# EAGLE design dc_controller_3 (EAGLE 4.16)
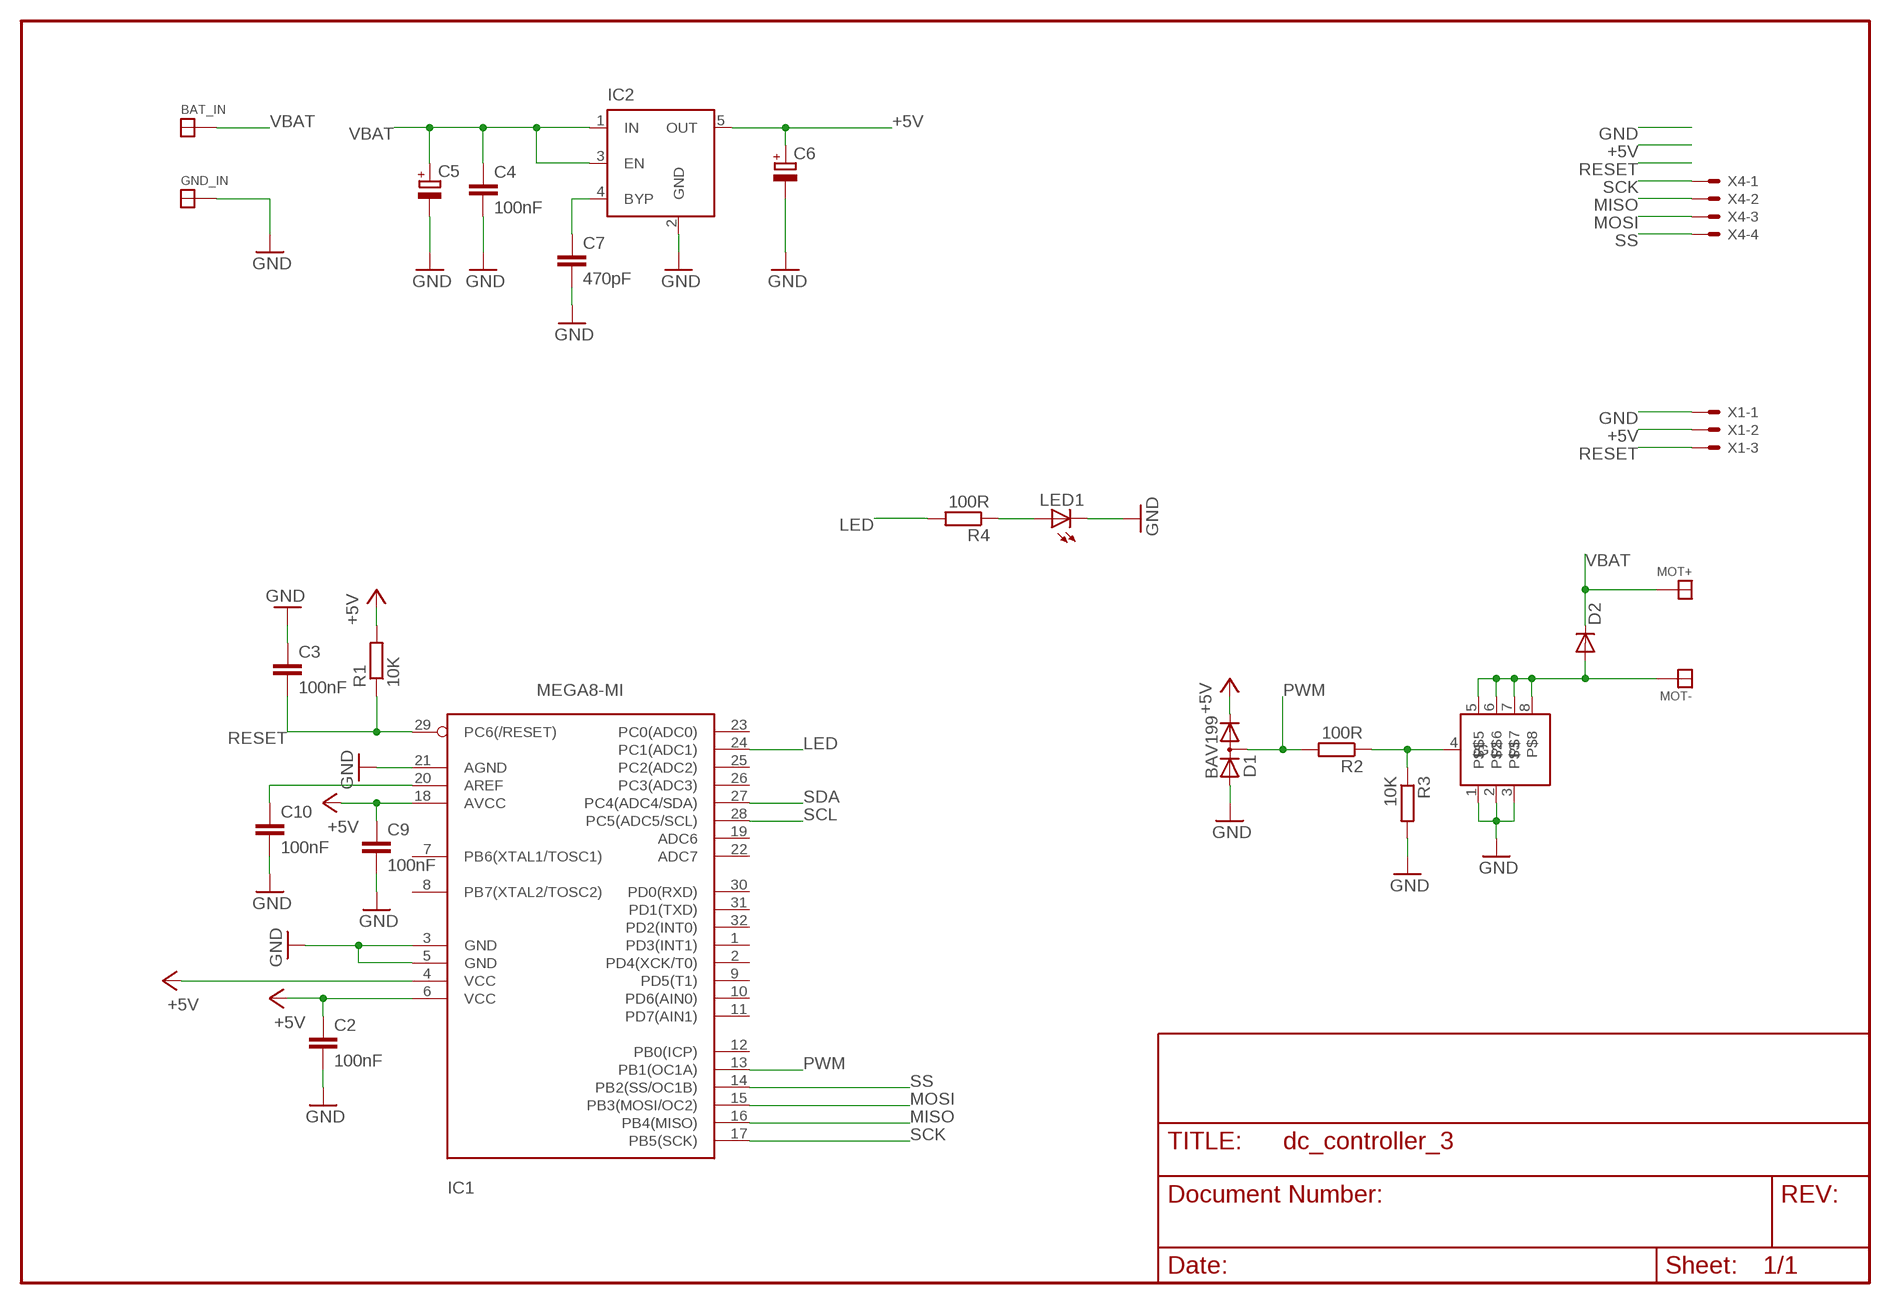
[diagram p0: schematic, sheet 1]

## Parts
BAT_IN  SOLDER_PAD100_50  [SOLDER_PAD_100_50]
C2  100nF  C-EUC0402K  [C0402K]
C3  100nF  C-EUC0402K  [C0402K]
C4  100nF  C-EUC0805  [C0805]
C5  CPOL-EUSMCB  [SMC_B]
C6  CPOL-EUSMCA  [SMC_A]
C7  470pF  C-EUC0402K  [C0402K]
C9  100nF  C-EUC0402K  [C0402K]
C10  100nF  C-EUC0402K  [C0402K]
D1  BAV199  [SOT23]
D2  DIODE-DO214BA  [DO214BA]
GND_IN  SOLDER_PAD100_50  [SOLDER_PAD_100_50]
IC1  MEGA8-MI  [MLF32]
IC2  MIC5219XX  [SOT23-5]
LED1  LEDCHIPLED_0805  [CHIPLED_0805]
MOT+  SOLDER_PAD100_50  [SOLDER_PAD_100_50]
MOT-  SOLDER_PAD100_50  [SOLDER_PAD_100_50]
R1  10K  R-EU_R0402  [R0402]
R2  100R  R-EU_R0402  [R0402]
R3  10K  R-EU_R0402  [R0402]
R4  100R  R-EU_R0402  [R0402]
U$1  IRF7809  [SO08]
X1  53047-03  [53047-03]
X4  53047-04  [53047-04]

## Nets
+5V: C2.1 C6.+ C9.1 D1.2(C) IC1.4(VCC) IC1.6(VCC) IC1.18(AVCC) IC2.5(OUT) R1.2 X1.2
GND: C2.2 C3.1 C4.2 C5.- C6.- C7.2 C9.2 C10.2 D1.1(A) GND_IN.P$1 IC1.3(GND) IC1.5(GND) IC1.21(AGND) IC2.2(GND) LED1.C R3.2 U$1.1 U$1.2 U$1.3 X1.1
LED: IC1.24(PC1(ADC1)) R4.2
MISO: IC1.16(PB4(MISO)) X4.2
MOSI: IC1.15(PB3(MOSI/OC2)) X4.3
MOT-: D2.A MOT-.P$1 U$1.5 U$1.6 U$1.7 U$1.8
N$1: C7.1 IC2.4(BYP)
N$4: LED1.A R4.1
N$5: C10.1 IC1.20(AREF)
N$6: R2.1 R3.1 U$1.4(G)
PWM: D1.3(AC) IC1.13(PB1(OC1A)) R2.2
RESET: C3.2 IC1.29(PC6(/RESET)) R1.1 X1.3
SCK: IC1.17(PB5(SCK)) X4.1
SCL: IC1.28(PC5(ADC5/SCL))
SDA: IC1.27(PC4(ADC4/SDA))
SS: IC1.14(PB2(SS/OC1B)) X4.4
VBAT: BAT_IN.P$1 C4.1 C5.+ D2.C IC2.1(IN) IC2.3(EN) MOT+.P$1
Unconnected: IC1.1(PD3(INT1)) IC1.2(PD4(XCK/T0)) IC1.7(PB6(XTAL1/TOSC1)) IC1.8(PB7(XTAL2/TOSC2)) IC1.9(PD5(T1)) IC1.10(PD6(AIN0)) IC1.11(PD7(AIN1)) IC1.12(PB0(ICP)) IC1.19(ADC6) IC1.22(ADC7) IC1.23(PC0(ADC0)) IC1.25(PC2(ADC2)) IC1.26(PC3(ADC3)) IC1.30(PD0(RXD)) IC1.31(PD1(TXD)) IC1.32(PD2(INT0))

## Library data of the parts
BAT_IN GND_IN MOT+ MOT- = paparazzi:SOLDER_PAD
C2-C4 C7 C9 C10 = rcl:C-EU: CAPACITOR, European symbol
C5 C6 = rcl:CPOL-EU: POLARIZED CAPACITOR, European symbol
D1 = diode:BAV199: DIODE low-leakage double diode
D2 = diode:DIODE-: DIODE
IC1 = atmel:MEGA8: MICROCONTROLLER 8 Kbytes FLASH 1 kbytes SRAM 512 bytes EEPROM USART 6-channel 10 bit ADC 2-channel 8 bit ADC Source: avr.lbr
IC2 = v-reg-micrel:MIC5219XX: VOLTAGE REGULATOR
LED1 = led:LED: LED OSRAM: - CHIPLED LG R971, LG N971, LY N971, LG Q971, LY Q971, LO R971, LY R971 LH N974, LH R974 LS Q976, LO Q976, LY Q976 LO Q996 - Hyper CHIPLED LW Q18S LB Q993, LB Q99A, LB R99A - SideLED LS A670, LO A670, LY A670, LG A670, LP A670 LB A673, LV A673, LT A673, LW A673 LH A674 LY A675 LS A676, LA A676, LO A676, LY A676, LW A676 LS A679, LY A679, LG A679 - Hyper Micro SIDELED® LS Y876, LA Y876, LO Y876, LY Y876 LT Y87S - SmartLED LW L88C, LW L88S LB L89C, LB L89S, LG L890 LS L89K, LO L89K, LY L89K LS L896, LA L896, LO L896, LY L896 - TOPLED LS T670, LO T670, LY T670, LG T670, LP T670 LSG T670, LSP T670, LSY T670, LOP T670, LYG T670 LG T671, LOG T671, LSG T671 LB T673, LV T673, LT T673, LW T673 LH T674 LS T676, LA T676, LO T676, LY T676, LB T676, LH T676, LSB T676, LW T676 LB T67C, LV T67C, LT T67C, LS T67K, LO T67K, LY T67K, LW E67C LS E67B, LA E67B, LO E67B, LY E67B, LB E67C, LV E67C, LT E67C LW T67C LS T679, LY T679, LG T679 LS T770, LO T770, LY T770, LG T770, LP T770 LB T773, LV T773, LT T773, LW T773 LH T774 LS E675, LA E675, LY E675, LS T675 LS T776, LA T776, LO T776, LY T776, LB T776 LHGB T686 LT T68C, LB T68C - Hyper Mini TOPLED® LB M676 - Mini TOPLED Santana® LG M470 LS M47K, LO M47K, LY M47K Source: http://www.osram.convergy.de/
R1-R4 = rcl:R-EU_: RESISTOR, European symbol
U$1 = paparazzi:IRF7809
X1 = con-molex:53?-03: CONNECTOR wire to board 1.25 mm (.049 inch) pitch header
X4 = con-molex:53?-04: CONNECTOR wire to board 1.25 mm (.049 inch) pitch header

## Board
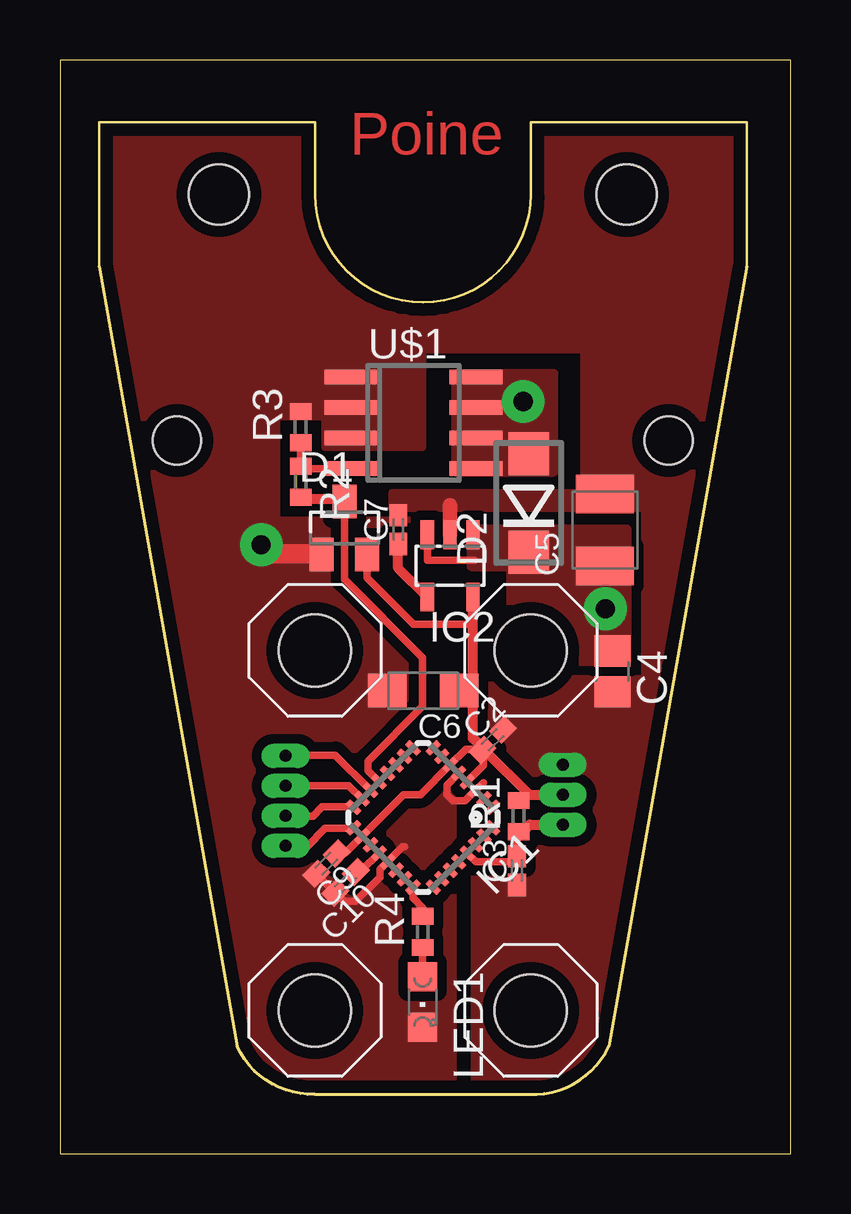
[diagram p1: board, top side]
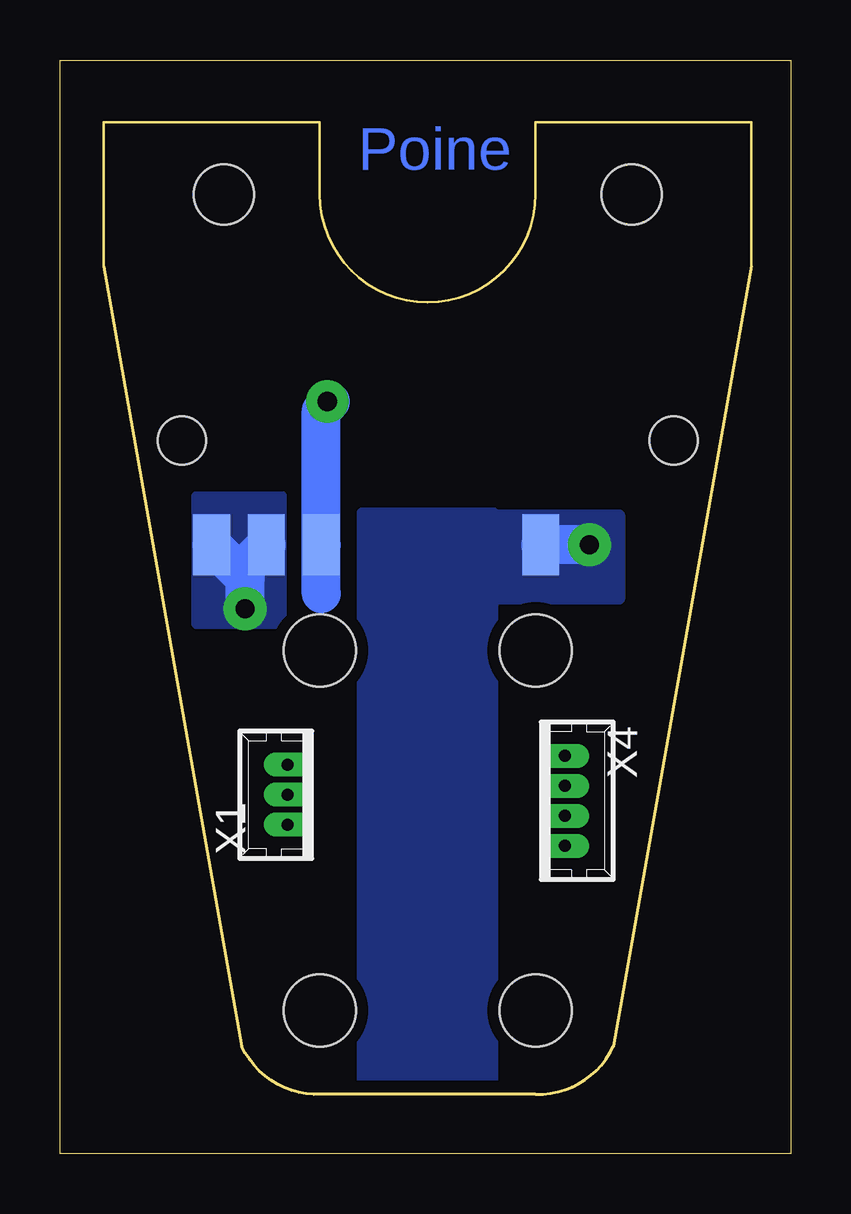
[diagram p2: board, bottom side, seen from below]

Size 30.46 x 45.57 mm. Coordinates in mm from the lower left corner, seen from the top.
Outline: 0,0 30.46,0 30.46,45.57 0,45.57 0,0
Outline: 1.63,42.97 10.63,42.97 10.63,39.97 arc180 19.63,39.97 19.63,42.97 28.63,42.97 28.63,36.97 22.88,4.47 arc-62 19.88,2.47 10.63,2.47 arc-66 7.38,4.47 1.63,36.97 1.63,42.97
Copper layers (1*16): Top 0.035mm / dielectric 1.5mm / Bottom 0.035mm
Design rules "default": minimum track width 10mil, minimum drill 24mil, track to track 8mil, track to pad 8mil, pad to pad 8mil, via to via 8mil, smd to smd 8mil, copper to edge 20mil, drill to drill 8mil, minimum pad ring 10mil, minimum via ring 8mil, stop-mask expansion 4mil, vias tented up to drill 0mil, thermal gap 10mil
Holes 2.5 mm at 6.63,39.97 23.63,39.97
Holes 2 mm at 4.88,29.72 25.38,29.72
Holes 3 mm at 10.63,20.97 19.63,20.97 10.63,5.97 19.63,5.97

### Footprints (pad centres in the part's own frame; a part is rotated, then mirrored left to right if it is on the bottom)
SOLDER_PAD_100_50 = smd 2.54 x 1.524: P$1 0,0
C0402K = smd 0.925 x 0.74: 1 -0.6,0; 2 0.6,0
C0805 = smd 1.3 x 1.5: 1 -0.85,0; 2 0.85,0
SMC_B = smd 1.6 x 2.4: + -1.5,0; - 1.5,0
SMC_A = smd 1.6 x 1.4: + -1.5,0; - 1.5,0
SOT23 = smd 1 x 1.4: 1 -0.95,-1.1; 2 0.95,-1.1; 3 0,1.1
DO214BA = smd 1.8 x 1.7: A 2.05,0; C -2.05,0
MLF32 = smd 0.7 x 0.3: 1 -2.35,1.75; 2 -2.35,1.25; 3 -2.35,0.75; 4 -2.35,0.25; 5 -2.35,-0.25; 6 -2.35,-0.75; 7 -2.35,-1.25; 8 -2.35,-1.75; 17 2.35,-1.75; 18 2.35,-1.25; 19 2.35,-0.75; 20 2.35,-0.25; 21 2.35,0.25; 22 2.35,0.75; 23 2.35,1.25; 24 2.35,1.75 | smd 0.3 x 0.7: 9 -1.75,-2.35; 10 -1.25,-2.35; 11 -0.75,-2.35; 12 -0.25,-2.35; 13 0.25,-2.35; 14 0.75,-2.35; 15 1.25,-2.35; 16 1.75,-2.35; 25 1.75,2.35; 26 1.25,2.35; 27 0.75,2.35; 28 0.25,2.35; 29 -0.25,2.35; 30 -0.75,2.35; 31 -1.25,2.35; 32 -1.75,2.35
SOT23-5 = smd 0.55 x 1.2: 1 -0.95,-1.3; 2 0,-1.3; 3 0.95,-1.3; 4 0.95,1.3; 5 -0.95,1.3
CHIPLED_0805 = smd 1.2 x 1.2: A 0,-1.05; C 0,1.05
R0402 = smd 0.7 x 0.9: 1 -0.65,0; 2 0.65,0
SO08 = smd 0.6 x 2.2: 1 -1.905,-2.6; 2 -0.635,-2.6; 3 0.635,-2.6; 4 1.905,-2.6; 5 1.905,2.6; 6 0.635,2.6; 7 -0.635,2.6; 8 -1.905,2.6
53047-03 = drill 0.5 pad 0.698 long: 1 1.25,0; 2 0,0; 3 -1.25,0
53047-04 = drill 0.5 pad 0.698 long: 1 1.875,0; 2 0.625,0; 3 -0.625,0; 4 -1.875,0

### Placement (x,y rotation side)
BAT_IN  21.85,25.37 90 bottom
C2  18.04,17.24 45 top
C3  19.05,11.79 90 top
C4  23.03,20.09 270 top
C5  22.72,25.99 90 top
C6  15.14,19.3 180 top
C7  14.1,26 90 top
C9  11.11,12.09 225 top
C10  11.91,11.31 225 top
D1  11.86,26.07 0 top
D2  19.54,27.11 90 top
GND_IN  10.42,25.37 90 bottom
IC1  15.14,14.01 225 top
IC2  16.26,24.49 180 top
LED1  15.12,6.32 180 top
MOT+  24.14,25.37 90 bottom
MOT-  19.56,25.37 270 bottom
R1  19.12,14.07 90 top
R2  10.04,28 270 top
R3  10.04,30.28 90 top
R4  15.12,9.24 90 top
U$1  14.74,30.45 270 top
U$2  [3MM_SCREW_HEAD]  10.63,20.97 0 top
U$3  [3MM_SCREW_HEAD]  19.63,20.97 0 top
U$4  [3MM_SCREW_HEAD]  10.63,5.97 0 top
U$5  [3MM_SCREW_HEAD]  19.63,5.97 0 top
X1  20.96,14.96 90 bottom
X4  9.41,14.7 270 bottom

### Tracks (layer width: path | path; a pad name or v marks a point on that pad's centre or on a via)
+5V
  Top 0.305: C9.1 11.56,12.54 11.91,12.54 IC1.18 14.32,14.96 15.03,14.96 IC1.6 16.93,16.86 17.66,16.86 | D1.2 12.81,24 14.74,22.07 17.21,22.07 | IC1.4 17.66,16.17 17.66,16.86 | 17.66,16.86 C2.1 | 19.56,14.96 19.58,14.94 19.42,14.94 19.18,14.7 19.17,14.72 R1.2 | C6.+ 16.66,19.27 17.21,19.27
  Top 0.406: IC2.5 17.21,22.07 17.21,19.27 17.21,17.31 17.66,16.86 19.56,14.96 X1.2
GND  (via drill 0.8 pad 1.78)
  Top 0.305: IC1.5 16.14,15.36 16.14,14.96 16.39,14.7 16.89,14.7 IC1.3 17.66,15.46 | C9.2 11.44,10.91 11.44,10.89 C10.2 11.82,10.55 11.82,10.51 12.33,10.51 13.34,11.53 13.34,11.86 IC1.21 14.28,12.8 14.36,12.8
  Top 0.61: 16.26,26.89 16.26,27.02 IC2.2
  Top 0.813: D1.1 10.9,24.99 8.64,24.99
  Bottom 1.626: v8.39,25.37 GND_IN.P$1
  pour Top (isolate 0.406, no thermals): 13.85,27.53 21.85,27.53 21.85,33.5 15.12,33.5 15.12,29.43 11.06,29.43 11.06,30.7 9.02,30.7 9.02,26.39 16.39,26.39 16.39,0.6 0.64,0.6 0.64,44.8 29.72,44.8 29.72,0.86 17.28,0.86 17.28,19.78 24.39,19.78 24.39,26.89 13.85,26.89
  pour Bottom (no thermals): 12.45,26.64 7.12,26.64 7.12,23.08 12.45,23.08
LED
  Top 0.305: R4.2 15.12,10.26 14.71,10.66 IC1.24
MISO
  Top 0.305: IC1.16 12.22,14.45 10.93,14.45 10.55,14.07 9.41,14.07 X4.2
MOSI
  Top 0.305: X4.3 12.04,15.34 IC1.15
MOT-  (via drill 0.8 pad 1.78)
  Bottom 1.626: v19.31,31.34 19.18,31.34 19.56,30.96 MOT-.P$1 19.56,23.34
  pour Top (isolate 0.305, no thermals): 16.52,28.42 20.58,28.42 20.58,32.48 16.52,32.48
N$1
  Top 0.406: 14.1,25.62 C7.1 14.1,24.4 IC2.4
N$2  (via drill 0.8 pad 1.78)
  other vias: 6.63,39.97
N$3
  pour Bottom: 12.38,26.71 17.88,26.71 17.88,2.76 12.38,2.76
N$4
  Top 0.305: 15.12,8.61 R4.1 LED1.A
N$5
  Top 0.305: C10.1 12.38,11.78 12.56,11.78 IC1.20
N$6
  Top 0.305: 10.14,28.54 10.04,28.54 | 10.14,28.54 R2.1 R3.1 | 10.14,28.54 U$1.4
N$7  (via drill 0.8 pad 1.78)
  other vias: 23.63,39.97
N$8  (via drill 0.8 pad 1.78)
  other vias: 4.88,29.72
N$9  (via drill 0.8 pad 1.78)
  other vias: 25.38,29.72
N$10  (via drill 0.8 pad 1.78)
  other vias: 10.63,20.97
N$11  (via drill 0.8 pad 1.78)
  other vias: 19.63,20.97
N$12  (via drill 0.8 pad 1.78)
  other vias: 10.63,5.97
N$13  (via drill 0.8 pad 1.78)
  other vias: 19.63,5.97
PWM
  Top 0.305: D1.3 11.86,23.93 15.12,20.67 15.12,18.64 12.83,16.35 12.83,15.96 IC1.13
  Top 0.406: D1.3 11.82,27.22 11.82,27.27 10.11,27.27 R2.2
RESET
  Top 0.305: IC1.29 17.34,12.16 19.06,12.16 C3.2 19.06,13.43 19.1,13.43 R1.1 19.12,13.37 19.18,13.31
  Top 0.406: X1.3 19.58,13.71 19.18,13.31
SCK
  Top 0.305: IC1.17 12.22,13.56 11.06,13.56 10.29,12.8 9.41,12.8 X4.1
SS
  Top 0.305: X4.4 9.41,16.61 11.48,16.61 IC1.14
VBAT  (via drill 0.8 pad 1.78)
  Top 0.305: IC2.3 15.31,24.73 17.28,24.73
  Bottom 1.626: BAT_IN.P$1 22.74,24.48 v22.74,22.7 22.74,23.97 MOT+.P$1
  pour Top (no thermals): 23.63,26 17.15,26 17.15,24.48 18.8,24.48 18.8,20.54 23.63,20.54
  pour Bottom (no thermals): 24.77,27.4 21.22,27.4 21.22,22.07 24.77,22.07

### Text on the board
Top: Poine
Bottom: Poine